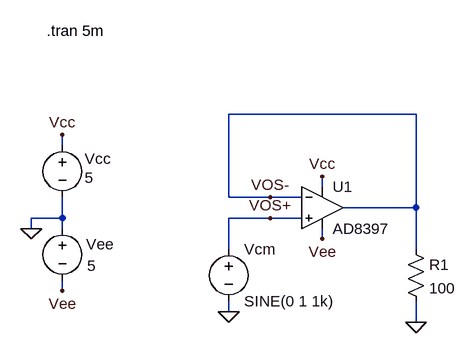
[diagram p0: schematic AD8397.asc]
AD8397.asc, the LTspice schematic file:
Version 4
SHEET 1 1704 1132
WIRE 352 160 64 160
WIRE -192 208 -192 192
WIRE 208 272 208 256
WIRE 64 288 64 160
WIRE 128 288 64 288
WIRE 176 288 128 288
WIRE 352 304 352 160
WIRE 352 304 240 304
WIRE -192 320 -192 288
WIRE -192 320 -240 320
WIRE 128 320 64 320
WIRE 176 320 128 320
WIRE -240 336 -240 320
WIRE -192 336 -192 320
WIRE 208 352 208 336
WIRE 64 368 64 320
WIRE 352 368 352 304
WIRE -192 432 -192 416
WIRE 64 464 64 448
WIRE 352 480 352 448
FLAG -240 336 0
FLAG 208 256 Vcc
FLAG 208 352 Vee
FLAG -192 192 Vcc
FLAG -192 432 Vee
FLAG 128 320 VOS+
FLAG 128 288 VOS-
FLAG 64 464 0
FLAG 352 480 0
DATAFLAG 352 304 ""
SYMBOL voltage -192 192 R0
WINDOW 123 0 0 Left 2
WINDOW 0 34 37 Left 2
WINDOW 3 34 66 Left 2
WINDOW 39 0 0 Left 0
SYMATTR InstName Vcc
SYMATTR Value 5
SYMBOL voltage -192 320 R0
WINDOW 123 0 0 Left 2
WINDOW 0 37 40 Left 2
WINDOW 3 38 73 Left 2
WINDOW 39 0 0 Left 0
SYMATTR InstName Vee
SYMATTR Value 5
SYMBOL voltage 64 352 R0
WINDOW 123 0 0 Left 0
WINDOW 39 0 0 Left 0
SYMATTR InstName Vcm
SYMATTR Value SINE(0 1 1k)
SYMBOL res 336 352 R0
SYMATTR InstName R1
SYMATTR Value 100
SYMBOL AD8397 208 240 R0
SYMATTR InstName U1
TEXT -216 32 Left 2 !.tran 5m

The netlist it stands for:
* AD8397.asc
Vcc Vcc 0 5
Vee 0 Vee 5
Vcm VOS+ 0 SINE(0 1 1k)
R1 VOS- 0 100
* U1: AD8397 (symbol AD8397 not available, pins judged from their places): In+=VOS+ In-=VOS- V+=Vcc V-=Vee OUT=VOS-
.tran 5m
.backanno
.end